# Altium schematic sheet Sheet3.SchDoc
size A; SheetNumber: 3; SheetTotal: 5
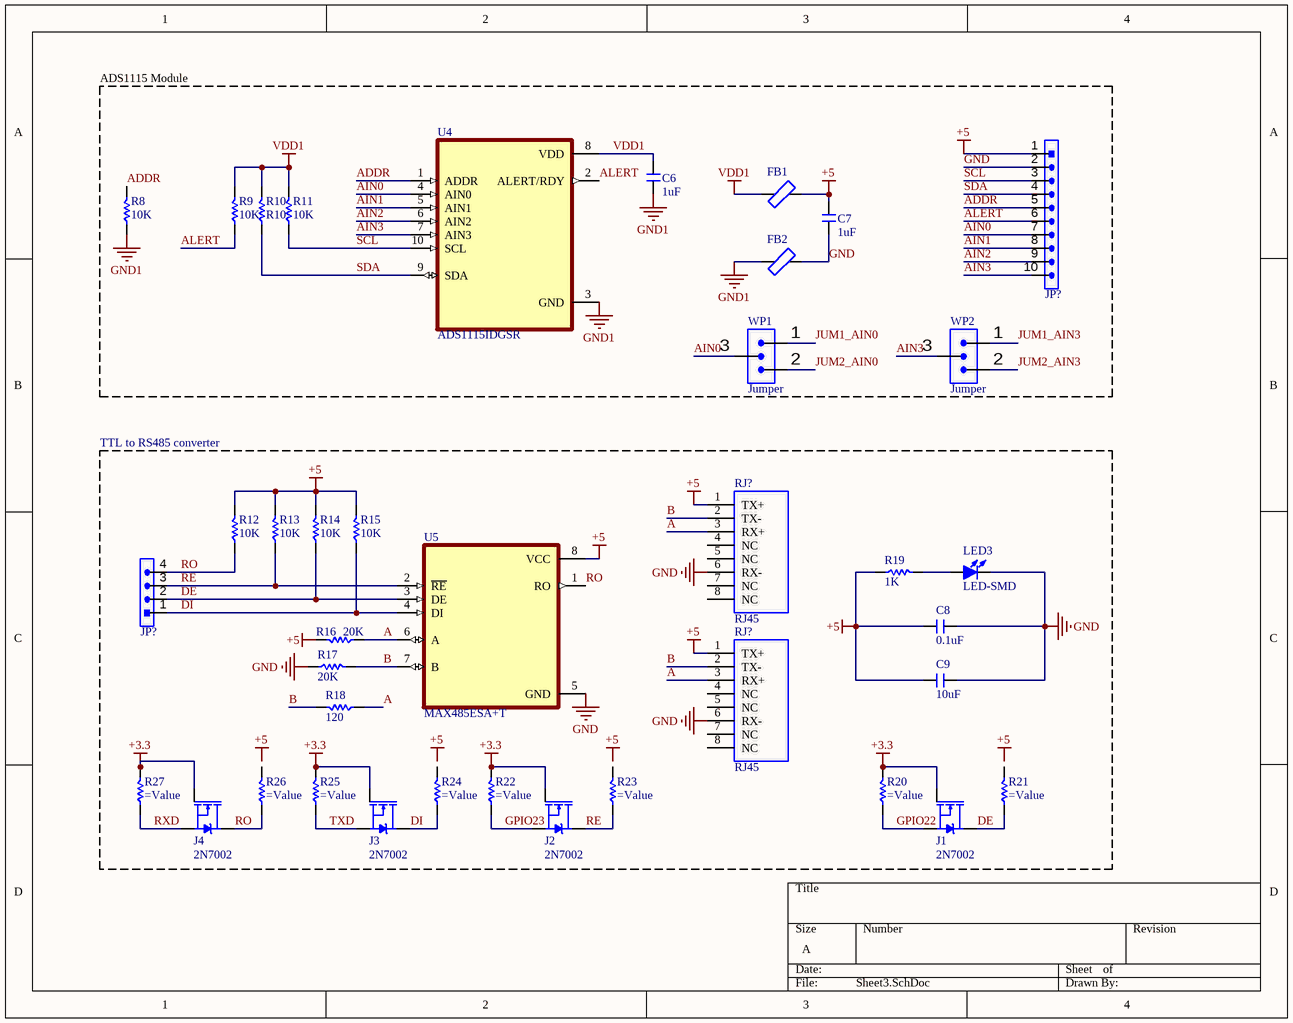
[diagram p0: Sheet3.SchDoc]

## Parts
(Parts that share a designator on the sheet are numbered #1, #2 ... from top to bottom, then left to right.)
C6  1uF  [C 0805]
C7  1uF  [C 0805]
C8  0.1uF  [C 0805]
C9  10uF  [C 1206]
FB1  (no value)  [F 0805]
FB2  (no value)  [F 0805]
J1  2N7002  [SOT23-3]
J2  2N7002  [SOT23-3]
J3  2N7002  [SOT23-3]
J4  2N7002  [SOT23-3]
JP?#1  HDR-1X10  [HDR-1X10]  (value not drawn)
JP?#2  HDR-1X4  [HDR-1X4]  (value not drawn)
LED3  LED-SMD  [LED 0805R]
R8  10K  [R 0805]
R9  10K  [R 0805]
R10  R10  [R 0805]
R11  10K  [R 0805]
R12  10K  [R 0805]
R13  10K  [R 0805]
R14  10K  [R 0805]
R15  10K  [R 0805]
R16  20K  [R 0805]
R17  20K  [R 0805]
R18  120  [R 0805]
R19  1K  [R 0805]
R20  (no value)  [R 0805]
R21  (no value)  [R 0805]
R22  (no value)  [R 0805]
R23  (no value)  [R 0805]
R24  (no value)  [R 0805]
R25  (no value)  [R 0805]
R26  (no value)  [R 0805]
R27  (no value)  [R 0805]
RJ?#1  RJ45  [RJ45-2]
RJ?#2  RJ45  [RJ45-2]
U4  ADS1115IDGSR  [SOP50P490X110-10N]
U5  MAX485ESA+T  [SOIC127P600X175-8N]
WP1  Jumper  [Jumper Selector]
WP2  Jumper  [Jumper Selector]

## Nets
+3.3: J1.1(G) J2.1(G) J3.1(G) J4.1(G) R20.2 R22.2 R25.2 R27.2
+5: C7.2 C8.1 C9.1 FB1.2 JP?#1.1 R12.2 R13.2 R14.2 R15.2 R16.2 R19.1 RJ?#1.1(TX+) RJ?#2.1(TX+) U5.8(VCC)
GND: C7.1 C8.2 C9.2 FB2.2 JP?#1.2 LED3.2(K) R17.1 RJ?#1.6(RX-) RJ?#2.6(RX-) U5.5(GND)
GND1: C6.1 FB2.1 R8.1 U4.3(GND)
VDD1: C6.2 FB1.1 R9.2 R10.2 R11.2 U4.8(VDD)
A: R16.1 R18.1 RJ?#1.3(RX+) RJ?#2.3(RX+) U5.6(A)
ADDR: JP?#1.5 R8.2 U4.1(ADDR)
AIN0: JP?#1.7 U4.4(AIN0) WP1.3(IN)
AIN1: JP?#1.8 U4.5(AIN1)
AIN2: JP?#1.9 U4.6(AIN2)
AIN3: JP?#1.10 U4.7(AIN3) WP2.3(IN)
ALERT: JP?#1.6 R9.1 U4.2(ALERT/RDY)
B: R17.2 R18.2 RJ?#1.2(TX-) RJ?#2.2(TX-) U5.7(B)
DE: J1.3(D) JP?#2.2 R14.1 R21.1 U5.3(DE)
DI: J3.3(D) JP?#2.1 R15.1 R24.1 U5.4(DI)
GPIO22: J1.2(S) R20.1
GPIO23: J2.2(S) R22.1
JUM1_AIN0: WP1.1(IN)
JUM1_AIN3: WP2.1(IN)
JUM2_AIN0: WP1.2(IN)
JUM2_AIN3: WP2.2(IN)
RE: J2.3(D) JP?#2.3 R13.1 R23.1 U5.2(~{RE})
RO: J4.3(D) JP?#2.4 R12.1 R26.1 U5.1(RO)
RXD: J4.2(S) R27.1
SCL: JP?#1.3 R11.1 U4.10(SCL)
SDA: JP?#1.4 R10.1 U4.9(SDA)
TXD: J3.2(S) R25.1
NetLED3_1: LED3.1(A) R19.2

Not connected (* = marked no-connect by the designer): R21 2; R23 2; R24 2; R26 2; RJ?#1 4(NC) 5(NC) 7(NC) 8(NC); RJ?#2 4(NC) 5(NC) 7(NC) 8(NC)

## Notes on the sheet
- ADS1115 Module
- TTL to RS485 converter
- Labels drawn without touching a wire or pin: +5

## Library data of the parts
C6-C9 = C: Non-polar patch capacitor; BOM名称: 无极性贴片电容; 版权归属: 源创客; 学习资源: www.ooocke.com
FB1 FB2 = FB: Ferrite Bead; BOM名称: 贴片电阻; 版权归属: 源创客; 学习资源: www.ooocke.com
J1-J4 = 2N7002: N-Channel 60V 115mA (Tc) 225mW (Ta) Surface Mount SOT-23-3 (TO-236); MF: STMicroelectronics; Package: SOT-23-3 Vishay; Value: *; Check_prices: https://www.snapeda.com/parts/2N7002/STMicroelectronics/view-part/2885412/?ref=eda; SnapEDA_Link: https://www.snapeda.com/parts/2N7002/STMicroelectronics/view-part/2885412/?ref=snap; Availability: Good; Price: None; MP: 2N7002; Purchase-URL: https://pricing.snapeda.com/search/part/2N7002/?ref=eda
JP?#1 = Header 10: 10P Connector; BOM名称: 10P接插件; 版权归属: 源创客; 学习资源: www.ooocke.com
JP?#2 = Header 4: 4P Connector; BOM名称: 4P接插件; 版权归属: 源创客; 学习资源: www.ooocke.com
LED3 = LED-SMD: Patch LED; BOM名称: 贴片LED; 版权归属: 源创客; 学习资源: www.ooocke.com
R8-R27 = R: Chip resistor; 版权归属: 源创客; BOM名称: Chip resistor; 学习资源: www.ooocke.com
RJ?#1 RJ?#2 = RJ45: Ethernet interface; BOM名称: 以太网接口; 版权归属: 源创客; 学习资源: www.ooocke.com
U4 = ADS1115IDGSR: 16-Bit 860SPS 4-Ch Delta-Sigma ADC With PGA, Oscillator, Vref, Comparator, and I2C 10-VSSOP -40 to 125; MF: Texas Instruments; SnapEDA_Link: https://www.snapeda.com/parts/ADS1115IDGSR/Texas%20Instruments/view-part/45903/?ref=snap; Value: *; Texas_Instruments-Purchase-URL: https://snapeda.com/shop?store=Texas+Instruments&id=45903; Price: None; Availability: Good; Mouser-Purchase-URL: https://snapeda.com/shop?store=Mouser&id=45903; MP: ADS1115IDGSR; Package: VSSOP-10 Texas Instruments; DigiKey-Purchase-URL: https://snapeda.com/shop?store=DigiKey&id=45903; BuyPart: https://www.snapeda.com/parts/ADS1115IDGSR/Texas%20Instruments/view-part/45903/?ref=eda
U5 = MAX485ESA+T: 1/1 Transceiver Half RS422, RS485 8-SOIC; MF: Maxim Integrated; Digi-Key_Purchase_URL: https://www.digikey.hu/product-detail/en/maxim-integrated/MAX485ESA-T/MAX485ESA-TCT-ND/3647897?utm_source=snapeda&utm_medium=aggregator&utm_campaign=symbol; Digi-Key_Part_Number: MAX485ESA+TCT-ND; SnapEDA_Link: https://www.snapeda.com/parts/MAX485ESA%2BT/Maxim%20Integrated/view-part/549140/?ref=snap; Package: SOIC-8 Maxim; Value: *; MP: MAX485ESA+T
WP1 WP2 = Jumper Selector